# Altium schematic sheet Driver_using_SON3x3_mosfet.SchDoc
size A4
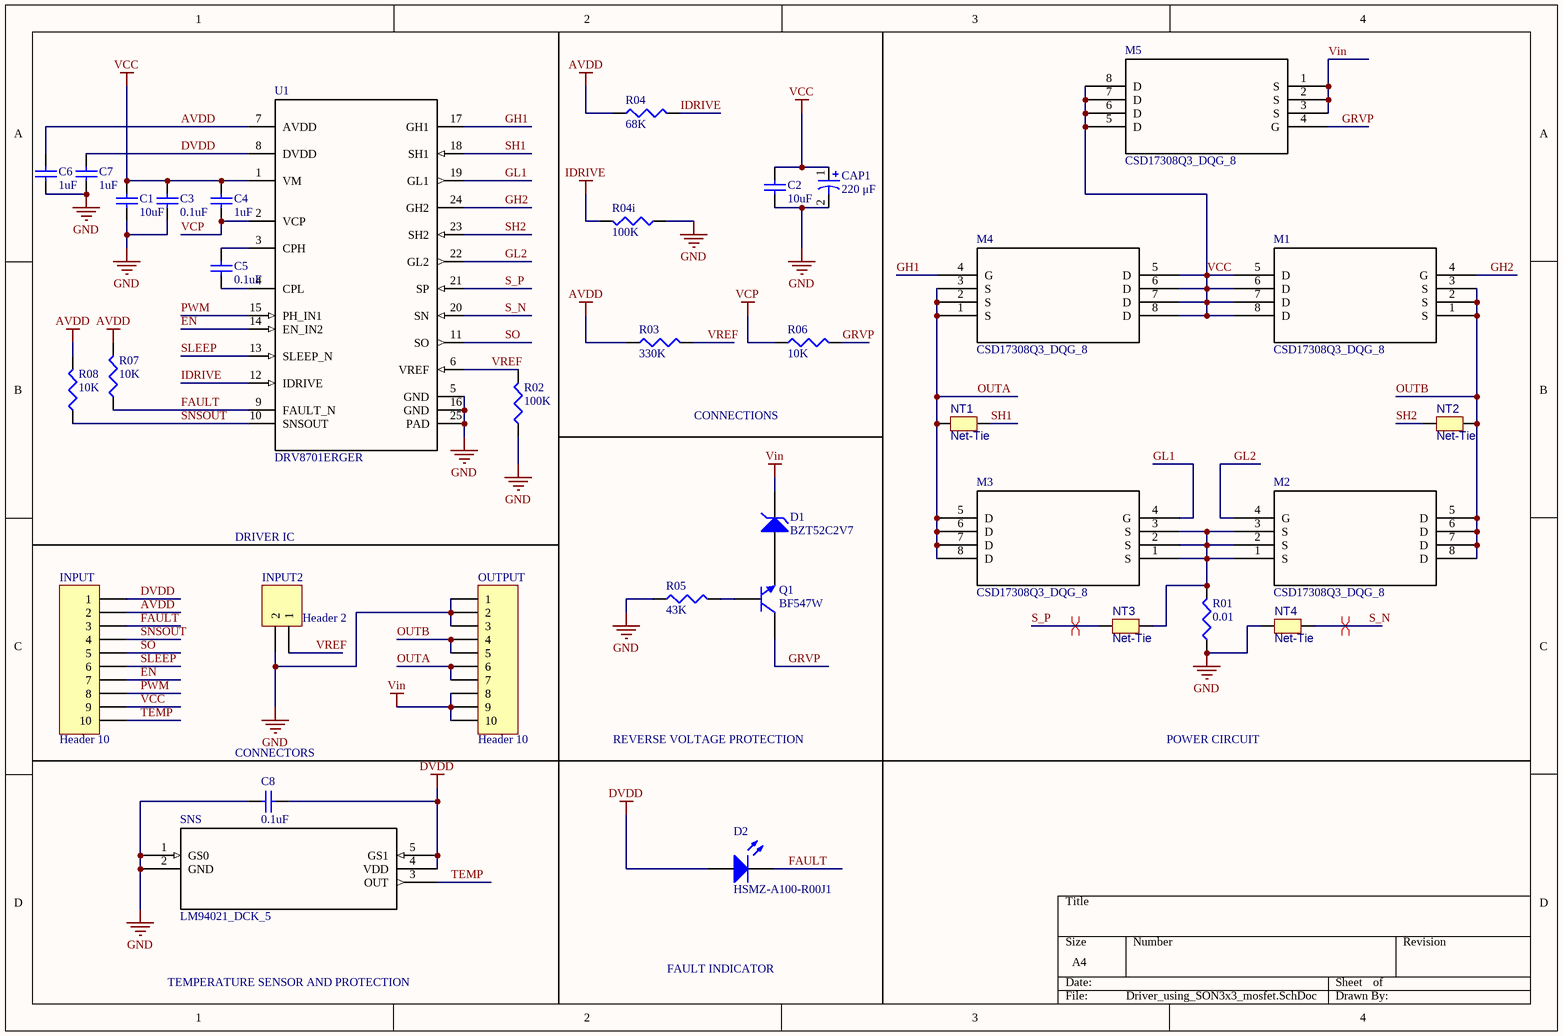
[diagram p0: Driver_using_SON3x3_mosfet.SchDoc]

## Parts
C1  10uF  [C1210]
C2  10uF  [C1210]
C3  0.1uF  [1608[0603]]
C4  1uF  [1608[0603]]
C5  0.1uF  [1608[0603]]
C6  1uF  [1608[0603]]
C7  1uF  [1608[0603]]
C8  0.1uF  [1608[0603]]
CAP1  220 μF  [WCAP-ASLL 10x10.5x4.5]
D1  BZT52C2V7  [SOD-123]
D2  HSMZ-A100-R00J1  [3.5X2.8X1.9]
INPUT  Header 10  [HDR1X10]
INPUT2  Header 2  [HDR1X2]
M1  CSD17308Q3_DQG_8  [DQG8]
M2  CSD17308Q3_DQG_8  [DQG8]
M3  CSD17308Q3_DQG_8  [DQG8]
M4  CSD17308Q3_DQG_8  [DQG8]
M5  CSD17308Q3_DQG_8  [DQG8]
NT1  Net-Tie  [2way_LP]  (net tie, no BOM)
NT2  Net-Tie  [2way_LP]  (net tie, no BOM)
NT3  Net-Tie  [2way_LP]  (net tie, no BOM)
NT4  Net-Tie  [2way_LP]  (net tie, no BOM)
OUTPUT  Header 10  [HDR1X10]
Q1  BF547W  [SOT323_N]
R01  0.01  [14-1210]
R02  100K  [J1-0603]
R03  330K  [J1-0603]
R04  68K  [J1-0603]
R04i  100K  [J1-0603]
R05  43K  [J1-0603]
R06  10K  [J1-0603]
R07  10K  [J1-0603]
R08  10K  [J1-0603]
SNS  LM94021_DCK_5  [MAA05A]
U1  DRV8701ERGER  [RGE0024F]

## Nets
AVDD: C6.1 INPUT.2 R03.1 R04.1 R07.2 R08.2 U1.7(AVDD)
DVDD: C7.1 C8.1 D2.1(A) INPUT.1 SNS.4(VDD) SNS.5(GS1) U1.8(DVDD)
GND: C1.1 C2.1 C3.1 C6.2 C7.2 C8.2 CAP1.2 INPUT2.2 NT4.1 OUTPUT.1 OUTPUT.2 OUTPUT.3 R01.1 R02.1 R04i.1 R05.1 SNS.1(GS0) SNS.2(GND) U1.5(GND) U1.16(GND) U1.25(PAD)
IDRIVE: R04.2 R04i.2 U1.12(IDRIVE)
VCC: C1.2 C2.2 C3.2 C4.1 CAP1.1 INPUT.9 M1.5(D) M1.6(D) M1.7(D) M1.8(D) M4.5(D) M4.6(D) M4.7(D) M4.8(D) M5.5(D) M5.6(D) M5.7(D) M5.8(D) U1.1(VM)
VCP: C4.2 R06.1 U1.2(VCP)
Vin: D1.2(K) M5.1(S) M5.2(S) M5.3(S) OUTPUT.8 OUTPUT.9 OUTPUT.10
EN: INPUT.7 U1.14(EN_IN2)
FAULT: D2.2(K) INPUT.3 R07.1 U1.9(FAULT_N)
GH1: M4.4(G) U1.17(GH1)
GH2: M1.4(G) U1.24(GH2)
GL1: M3.4(G) U1.19(GL1)
GL2: M2.4(G) U1.22(GL2)
GRVP: M5.4(G) Q1.3(C) R06.2
OUTA: M3.5(D) M3.6(D) M3.7(D) M3.8(D) M4.1(S) M4.2(S) M4.3(S) NT1.1 OUTPUT.6 OUTPUT.7
OUTB: M1.1(S) M1.2(S) M1.3(S) M2.5(D) M2.6(D) M2.7(D) M2.8(D) NT2.2 OUTPUT.4 OUTPUT.5
PWM: INPUT.8 U1.15(PH_IN1)
S_N: NT4.2 U1.20(SN)
S_P: NT3.1 U1.21(SP)
SH1: NT1.2 U1.18(SH1)
SH2: NT2.1 U1.23(SH2)
SLEEP: INPUT.6 U1.13(SLEEP_N)
SNSOUT: INPUT.4 R08.1 U1.10(SNSOUT)
SO: INPUT.5 U1.11(SO)
TEMP: INPUT.10 SNS.3(OUT)
VREF: INPUT2.1 R02.2 R03.2 U1.6(VREF)
NetC5_1: C5.1 U1.4(CPL)
NetC5_2: C5.2 U1.3(CPH)
NetD1_1: D1.1(A) Q1.2(E)
NetM2_1: M2.1(S) M2.2(S) M2.3(S) M3.1(S) M3.2(S) M3.3(S) NT3.2 R01.2
NetQ1_1: Q1.1(B) R05.2

## Layout directives
differential pair: S_N, S_P

## Notes on the sheet
- CONNECTIONS
- DRIVER IC
- (near C8) CONNECTORS
- REVERSE VOLTAGE PROTECTION
- POWER CIRCUIT
- TEMPERATURE SENSOR AND PROTECTION
- FAULT INDICATOR

## Library data of the parts
C1-C8 = Cap Semi: Capacitor (Semiconductor SIM Model); Published: 8-Jun-2000; LatestRevisionDate: 29-May-2009; LatestRevisionNote: IPC-7351 Footprint Added.; PackageReference: C1206; Publisher: Altium Limited; PackageDescription: Chip Capacitor
  C1 C2: Value: 10uF
  C3 C5 C8: Value: 0.1uF
  C4 C6 C7: Value: 1uF
CAP1 = WCAP-ASLL 10x10.5x4.5 865060557008: WCAP-ASLL Aluminum Electrolytic Capacitors , 220 μF; + / - 20%; 35 V , 10 x 10,5; Manufacturer: Wurth Elektronik; E-mail: libraries@we-online.com; Characteristics: Aluminum Electrolytic Capacitor;Recommended soldering: Reflow;Operating temperature: –55 °C to +105 °C;Low impedance product series;Load life: 2000–5000 h @ +105 °C; ComponentLink1Description: Manufacturer; ComponentLink1URL: http://www.we-online.com; ComponentLink2Description: Datasheet; ComponentLink2URL: http://katalog.we-online.de/pbs/datasheet/865060557008.pdf; Created by: Karrer Zheng; Created Date: 5/13/2015; Capacitance: 220 μF; Application: Energy storage or high frequency filtering in the low voltage circuit; used as power supply filtering in general switching power supply, DC-DC converter, AC-DC converter, conversion adapter, charger, TV, VCR, DC motor circuit filter, digital audio, digital TV, digital camera, digital video camera, satellite receiver, equipment control panel and etc.; partNo: 865060557008
D1 = BZT52C2V7: Surface Mount Zener Diode; Published: 8-Jun-2000; LatestRevisionDate: 17-Jul-2002; LatestRevisionNote: Re-released for DXP Platform.; DatasheetDocument: REV. L-2; PackageReference: SOD-123; Publisher: Altium Limited; ComponentLink1Description: Manufacturer Link; ComponentLink1URL: http://www.vishay.com/
D2 = HSMZ-A100-R00J1: Surface Mount LED Indicator, Red; LuminousIntensity: 100mcd (Minimum).; PCB_Layout: Complies with manufacturer's recommendation.; Published: 11-Dec-2002; DatasheetVersion: 16-Apr-2002; PackageVersion: Apr-2002; PackageReference: 3.5X2.8X1.9; Publisher: Altium Limited; PackageDescription: SM LED; 2 C-Bend Leads; Body 3.5 x 2.8 x 1.9 mm, inc leads (LxWxH typ); LED_Colour: Red; ComponentLink1Description: Manufacturer Link; ComponentLink1URL: http://www.avagotech.com/; ComponentLink2Description: Datasheet; ComponentLink2URL: http://cp.literature.agilent.com/litweb/pdf/5988-6546EN.pdf
INPUT OUTPUT = Header 10: Header, 10-Pin; LatestRevisionDate: 17-Jul-2002; LatestRevisionNote: Re-released for DXP Platform.; Publisher: Altium Limited
INPUT2 = Header 2: Header, 2-Pin; LatestRevisionDate: 17-Jul-2002; LatestRevisionNote: Re-released for DXP Platform.; Publisher: Altium Limited
M1-M5 = CSD17308Q3_DQG_8: Imported; Manufacturer: Texas Instruments; INDUSTRY_STD_PKG_TYPE: SON; FAMILY_NAME: N-Channel MOSFET Transistors; PIN_COUNT: 8; PACKAGE_DESIGNATOR: DQG; Datasheet URL: http://www.ti.com/lit/gpn/CSD17308Q3; GENERIC_PART_NUMBER: CSD17308Q3; RefDes: RefDes; Type: DEV; Value: Value
NT1-NT4 = Net-Tie: Single point connection between nets.; SymbolCreator: codlsc; SymbolVersion: 2009-07-01; MountType: SMT; PackageReference: N/A; Publisher: Texas Instruments; LatestRevisionDate: 2014-12-30; LatestRevisionNote: Added Alternate PartNumber and Alternate Manufacturer parameters to appropriate components.
Q1 = BF547W: NPN 1 GHz Wideband Transistor; ComponentAvailability: Obsolete; Published: 17-Sep-2003; LatestRevisionDate: 12-Dec-2006; LatestRevisionNote: IPC-7351 Footprint Added.; DatasheetVersion: Jun-1994; PackageVersion: Apr-1999; PackageReference: SOT323; Publisher: Altium Limited; PackageDescription: 3-Pin SOT-323 Package 0.65 mm Pitch, 2.1 mm Lead Span; ComponentLink1Description: Manufacturer Link; ComponentLink1URL: http://www.semiconductors.philips.com/; ComponentLink2Description: Datasheet; ComponentLink2URL: http://www.semiconductors.philips.com/acrobat/datasheets/BF547W_2.pdf; ComponentLink3Description: Discontinuation Notice; ComponentLink3URL: http://www.semiconductors.philips.com/pip/old/BF547W.html
R01 R02 R03 R04 R04i R05 R06 R07 R08 = Res3: Resistor; Published: 8-Jun-2000; LatestRevisionDate: 29-May-2009; LatestRevisionNote: IPC-7351 Footprint Added.; PackageReference: J1-0603; Publisher: Altium Limited; PackageDescription: Chip Resistor
  R01: Value: 0.01
  R02 R04i: Value: 100K
  R03: Value: 330K
  R04: Value: 68K
  R05: Value: 43K
  R06 R07 R08: Value: 10K
SNS = LM94021_DCK_5: Imported; Manufacturer: Texas Instruments; DatasheetURL: http://www.ti.com/lit/ds/symlink/lm94021.pdf; basePN: LM94021; NSC_PackageReference: MAA05A; Manufacturer_Part_Number: lm94021_dck_5; Vendor: Texas Instruments; RefDes: RefDes; Type: DEV; Value: Value
U1 = DRV8701ERGER: Imported; Alternate PartNumber: DRV8701ERGET; Manufacturer: Texas Instruments; CompType: IC; PIN_COUNT: 25; Application_BuildNumber: *; PartNumber: DRV8701ERGER; PackageReference: RGE0024F; MountType: SMT; RefDes: RefDes; Type: DEV; Value: Value